# Altium project Tremolo.PrjPCB
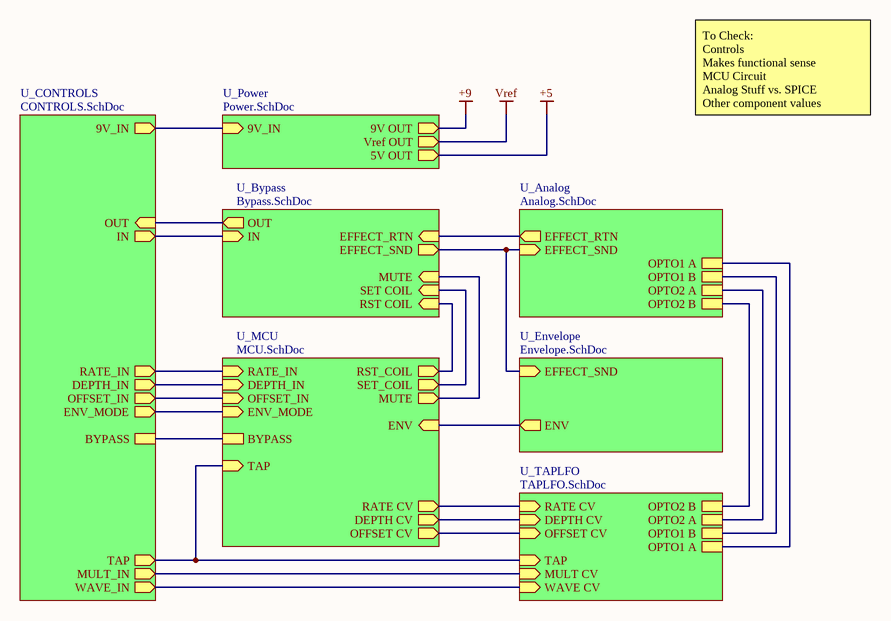
[diagram p0: MASTER.SchDoc]
6 sheets, 80 parts. Net scope: hierarchical (ports join the sheet entries above them; power ports are global).
Board file: PCB1.PcbDoc
Sheets:
  MASTER.SchDoc
    U_Analog = Analog.SchDoc
    U_Bypass = Bypass.SchDoc
    U_MCU = MCU.SchDoc
    U_Power = Power.SchDoc
    U_TAPLFO = TAPLFO.SchDoc

## Sheet MASTER.SchDoc
size A

### Sub-sheets
U_Analog = Analog.SchDoc: EFFECT_RTN (out), EFFECT_SND (in), OPTO1 A, OPTO1 B, OPTO2 A, OPTO2 B
U_Bypass = Bypass.SchDoc: EFFECT_RTN (in), IN (in), OUT (out), EFFECT_SND (out), MUTE (in), RST COIL (in), SET COIL (in)
U_CONTROLS = CONTROLS.SchDoc (file not in this document): RATE_IN (out), DEPTH_IN (out), OFFSET_IN (out), MULT_IN (out), IN (out), OUT (in), WAVE_IN (out), TAP (out), 9V_IN (out), BYPASS, ENV_MODE (out)
U_Envelope = Envelope.SchDoc (file not in this document): EFFECT_SND (in), ENV (out)
U_MCU = MCU.SchDoc: RATE_IN (in), OFFSET_IN (in), RATE CV (out), DEPTH CV (out), OFFSET CV (out), TAP (in), MUTE (out), SET_COIL (out), RST_COIL (out), BYPASS, ENV (in), DEPTH_IN (in), ENV_MODE (in)
U_Power = Power.SchDoc: 9V_IN (in), Vref OUT (out), 9V OUT (out), 5V OUT (out)
U_TAPLFO = TAPLFO.SchDoc: RATE CV (in), WAVE CV (in), MULT CV (in), DEPTH CV (in), OFFSET CV (in), TAP (in), OPTO1 A, OPTO1 B, OPTO2 A, OPTO2 B

### Nets
+9: sheet U_CONTROLS/9V_IN, sheet U_Power/9V_IN, sheet U_Power/9V OUT
ENV_MODE: sheet U_CONTROLS/ENV_MODE, sheet U_MCU/ENV_MODE
MUTE: sheet U_Bypass/MUTE, sheet U_MCU/MUTE
RESET_COIL: sheet U_Bypass/RST COIL, sheet U_MCU/RST_COIL
SET_COIL: sheet U_Bypass/SET COIL, sheet U_MCU/SET_COIL
Net*_4: sheet U_CONTROLS/TAP, sheet U_MCU/TAP, sheet U_TAPLFO/TAP
NetC1_1: sheet U_Analog/OPTO1 A, sheet U_TAPLFO/OPTO1 A
NetC3_1: sheet U_Analog/EFFECT_SND, sheet U_Bypass/EFFECT_SND, sheet U_Envelope/EFFECT_SND
NetC7_2: sheet U_MCU/DEPTH CV, sheet U_TAPLFO/DEPTH CV
NetC8_2: sheet U_MCU/RATE CV, sheet U_TAPLFO/RATE CV
NetC9_2: sheet U_MCU/OFFSET CV, sheet U_TAPLFO/OFFSET CV
NetJ1_2: sheet U_CONTROLS/DEPTH_IN, sheet U_MCU/DEPTH_IN
NetJ2_2: sheet U_CONTROLS/RATE_IN, sheet U_MCU/RATE_IN
NetJ3_2: sheet U_CONTROLS/OFFSET_IN, sheet U_MCU/OFFSET_IN
NetR4_2: sheet U_Analog/OPTO1 B, sheet U_Analog/OPTO2 B, sheet U_TAPLFO/OPTO1 B, sheet U_TAPLFO/OPTO2 B
NetR5_1: sheet U_Analog/OPTO2 A, sheet U_TAPLFO/OPTO2 A
NetR18_2: sheet U_CONTROLS/WAVE_IN, sheet U_TAPLFO/WAVE CV
NetR21_2: sheet U_CONTROLS/MULT_IN, sheet U_TAPLFO/MULT CV
NetS3_3: sheet U_Bypass/IN, sheet U_CONTROLS/IN
NetS3_7: sheet U_Analog/EFFECT_RTN, sheet U_Bypass/EFFECT_RTN
NetS3_8: sheet U_Bypass/OUT, sheet U_CONTROLS/OUT
NetU4_24: sheet U_CONTROLS/BYPASS, sheet U_MCU/BYPASS
NetU4_25: sheet U_MCU/ENV, sheet U_Envelope/ENV

### Notes on the sheet
- To Check:
  Controls
  Makes functional sense
  MCU Circuit
  Analog Stuff vs. SPICE
  Other component values

## Sheet Analog.SchDoc
size A
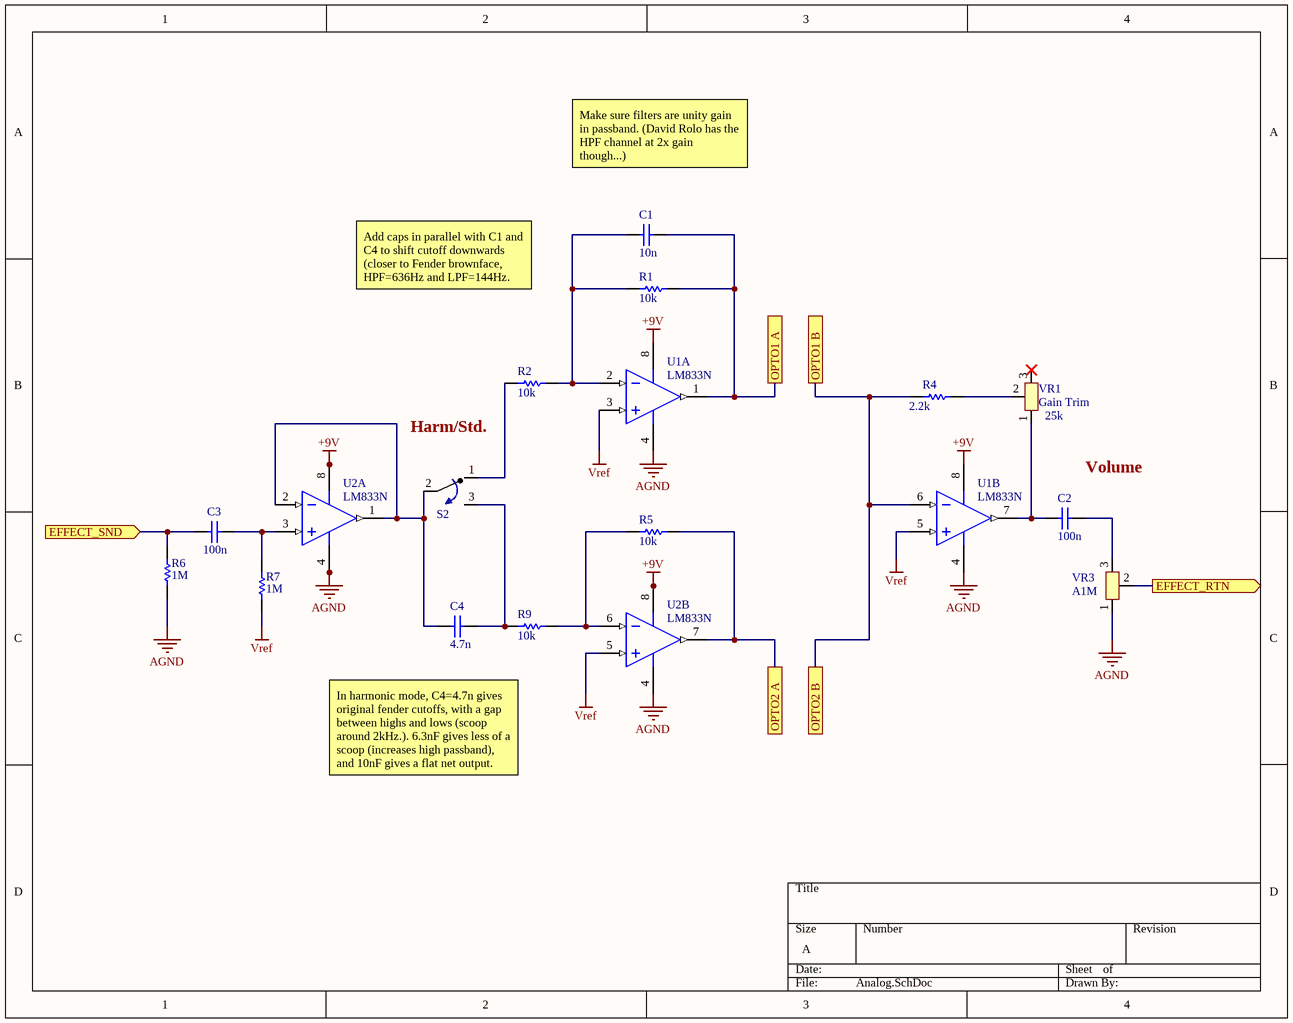
[diagram p1: Analog.SchDoc]

### Parts
C1  value 10n  [RAD-0.3]  (hidden comment: Cap)
C2  value 100n  [RAD-0.3]  (hidden comment: Cap)
C3  value 100n  [RAD-0.3]  (hidden comment: Cap)
C4  value 4.7n  [RAD-0.3]  (hidden comment: Cap)
R1  value 10k  [AXIAL-0.3]  (hidden comment: Res1)
R2  value 10k  [AXIAL-0.3]  (hidden comment: Res1)
R4  value 2.2k  [AXIAL-0.3]  (hidden comment: Res1)
R5  value 10k  [AXIAL-0.3]  (hidden comment: Res1)
R6  value 1M  [AXIAL-0.3]  (hidden comment: Res1)
R7  value 1M  [AXIAL-0.3]  (hidden comment: Res1)
R9  value 10k  [AXIAL-0.3]  (hidden comment: Res1)
S2  SPDT Toggle  [SPDT Toggle]  (value not drawn)
U1  LM833N  [626-05]  (parts A,B of 2)
U2  LM833N  [626-05]  (parts A,B of 2)
VR1  Gain Trim  value 25k  [Trimpot - Bourns]
VR3  value A1M  [Pot-16mm]  (hidden comment: Pot-16mm)

### Ports
EFFECT_RTN (out), EFFECT_SND (in), OPTO1 A, OPTO1 B, OPTO2 A, OPTO2 B

### Nets
+9V: U1.8(V+) U2.8(V+)
AGND: R6.1 U1.4(V-) U2.4(V-) VR3.1
Vref: R7.1 U1.3(IN+) U1.5(IN+) U2.5(IN+)
NetC1_1: C1.1 R1.1 U1.1(OUT) ; port OPTO1 A
NetC1_2: C1.2 R1.2 R2.1 U1.2(IN-)
NetC2_1: C2.1 VR3.3
NetC2_2: C2.2 U1.7(OUT) VR1.1
NetC3_1: C3.1 R6.2 ; port EFFECT_SND
NetC3_2: C3.2 R7.2 U2.3(IN+)
NetC4_1: C4.1 R9.2 S2.3
NetC4_2: C4.2 S2.2 U2.1(OUT) U2.2(IN-)
NetR2_2: R2.2 S2.1
NetR4_1: R4.1 VR1.2
NetR4_2: R4.2 U1.6(IN-) ; port OPTO1 B, port OPTO2 B
NetR5_1: R5.1 U2.7(OUT) ; port OPTO2 A
NetR5_2: R5.2 R9.1 U2.6(IN-)
NetS3_7: VR3.2 ; port EFFECT_RTN

Not connected (* = marked no-connect by the designer): VR1 3*

### Notes on the sheet
- Make sure filters are unity gain in passband. (David Rolo has the HPF channel at 2x gain though...)
- Add caps in parallel with C1 and C4 to shift cutoff downwards (closer to Fender brownface, HPF=636Hz and LPF=144Hz.
- Harm/Std.
- (near C2) Volume
- In harmonic mode, C4=4.7n gives original fender cutoffs, with a gap between highs and lows (scoop around 2kHz.). 6.3nF gives less of a scoop (increases high passband), and 10nF gives a flat net output.

### Library data of the parts
C1-C4 = Cap: Capacitor; Published: 8-Jun-2000; LatestRevisionDate: 17-Jul-2002; LatestRevisionNote: Re-released for DXP Platform.; PackageReference: RAD-0.3; Publisher: Altium Limited; PackageDescription: Radial Cap, Thru-Hole; 2 Leads; 0.3 in Pin Spacing
R1 R2 R4-R7 R9 = Res1: Resistor; Published: 8-Jun-2000; LatestRevisionDate: 17-Jul-2002; LatestRevisionNote: Re-released for DXP Platform.; PackageReference: AXIAL-0.3; Publisher: Altium Limited; PackageDescription: Axial Device, Thru-Hole; 2 Leads; 0.3 in Pin Spacing
U1 U2 = LM833N: Low-Noise, Audio Dual Operational Amplifier; Published: 28-Feb-2003; DatasheetVersion: Jan-2002, Rev. 2; PackageVersion: 1998; PackageReference: 626-05; Publisher: Altium Limited; PackageDescription: DIP; 8 Leads; Row Spacing 7.62 mm; Pitch 2.54 mm; ComponentLink1Description: Manufacturer Link; ComponentLink1URL: http://www.onsemi.com/; ComponentLink2Description: Datasheet; ComponentLink2URL: http://www.onsemi.com/pub/Collateral/LM833-D.PDF
VR1 = Trimpot - Bourns

## Sheet Bypass.SchDoc
size A
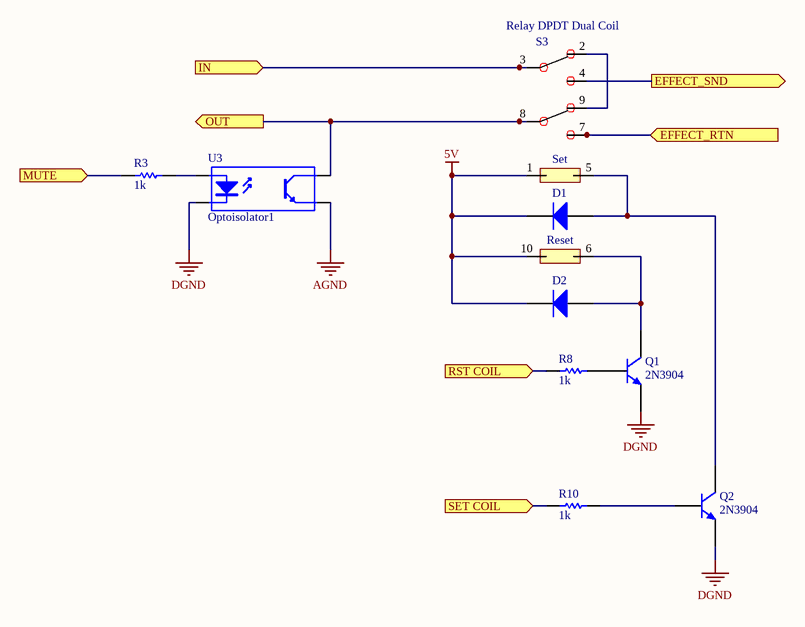
[diagram p2: Bypass.SchDoc]

### Parts
D1  Diode 1N4148  [DO-35]  (value not drawn)
D2  Diode 1N4148  [DO-35]  (value not drawn)
Q1  2N3904  [TO-92A]
Q2  2N3904  [TO-92A]
R3  1k  [ERA-0805]
R8  1k  [ERA-0805]
R10  1k  [ERA-0805]
S3  Relay DPDT Dual Coil  [EB2 Relay]
U3  Optoisolator1  [DIP-4]

### Ports
EFFECT_RTN (in), EFFECT_SND (out), IN (in), MUTE (in), OUT (out), RST COIL (in), SET COIL (in)

### Nets
5V: D1.2(K) D2.2(K) S3.1 S3.10
AGND: U3.3(E)
DGND: Q1.1(E) Q2.1(E) U3.2(K)
MUTE: R3.2 ; port MUTE
RESET_COIL: R8.2 ; port RST COIL
SET_COIL: R10.2 ; port SET COIL
NetC3_1: S3.4 ; port EFFECT_SND
NetD1_1: D1.1(A) Q2.3(C) S3.5
NetD2_1: D2.1(A) Q1.3(C) S3.6
NetQ1_2: Q1.2(B) R8.1
NetQ2_2: Q2.2(B) R10.1
NetR3_1: R3.1 U3.1(A)
NetS3_2: S3.2 S3.9
NetS3_3: S3.3 ; port IN
NetS3_7: S3.7 ; port EFFECT_RTN
NetS3_8: S3.8 U3.4(C) ; port OUT

### Notes on the sheet
- (in symbol Relay DPDT Dual Coil) Set; Reset

### Library data of the parts
D1 D2 = Diode 1N4148: High Conductance Fast Diode; Published: 8-Jun-2000; LatestRevisionDate: 17-Jul-2002; LatestRevisionNote: Re-released for DXP Platform.; DatasheetVersion: 1997; PackageReference: DO-35; Publisher: Altium Limited; PackageDescription: Diode, Axial; Body 3.8 x 1.9 mm (LxDia. max), Lead Dia. 0.53 mm (max); Code_JEDEC: DO-204-AH; ComponentLink1Description: Manufacturer Link; ComponentLink1URL: http://www.fairchildsemi.com/; ComponentLink2Description: Datasheet; ComponentLink2URL: http://www.fairchildsemi.com/ds/1N%2F1N4148.pdf
Q1 Q2 = 2N3904: NPN General Purpose Amplifier; Published: 8-Jun-2000; LatestRevisionDate: 15-Jan-2003; LatestRevisionNote: PCB Footprint 'BCY-W3/D4.7' replaced; DatasheetVersion: 1997; PackageVersion: Sep-1998; PackageReference: TO-92A; Publisher: Altium Limited; PackageDescription: TO, Flat Index; 3 In-Line, Axial Leads; Body Dia. 4.5mm; Leads 0.51 x 0.48 mm (max); ComponentLink1Description: Manufacturer Link; ComponentLink1URL: http://www.fairchildsemi.com/; ComponentLink2Description: Datasheet; ComponentLink2URL: http://www.fairchildsemi.com/ds/2N%2F2N3904.pdf
R3 R8 R10 = ERAS: Metal Film Thermosensitive Chip Resistor, 0.56 Ohm to 10k Ohm Range, 5% Tolerance, 0805 Size, 0.1 W; Note: If flow soldering, adjust pad width of PCB Footprint to 0.7 - 0.8 times the width of the resistor.; Published: 17-Dec-2003; LatestRevisionDate: 19-Mar-2004; LatestRevisionNote: Silkscreen size reduced.; PackageDocument: Mar-2003; PackageReference: ERA-0805; Publisher: Altium Limited; Code_IPC: 2012 [0805]; ComponentLink1Description: Manufacturer Link; ComponentLink1URL: http://www.panasonic.com/industrial/components/resistive_products.htm; ComponentLink2Description: Datasheet; ComponentLink2URL: http://www.panasonic.com/industrial/components/pdf/AOF0000CE1.pdf
U3 = Optoisolator1: 4-Pin Phototransistor Optocoupler; Published: 24-Mar-1999; LatestRevisionDate: 04-Mar-2005; LatestRevisionNote: Sch pins 3 & 4 Swapped.; DatasheetVersion: Nov-2003; PackageReference: DIP-4; Publisher: Altium Limited

## Sheet MCU.SchDoc
size A
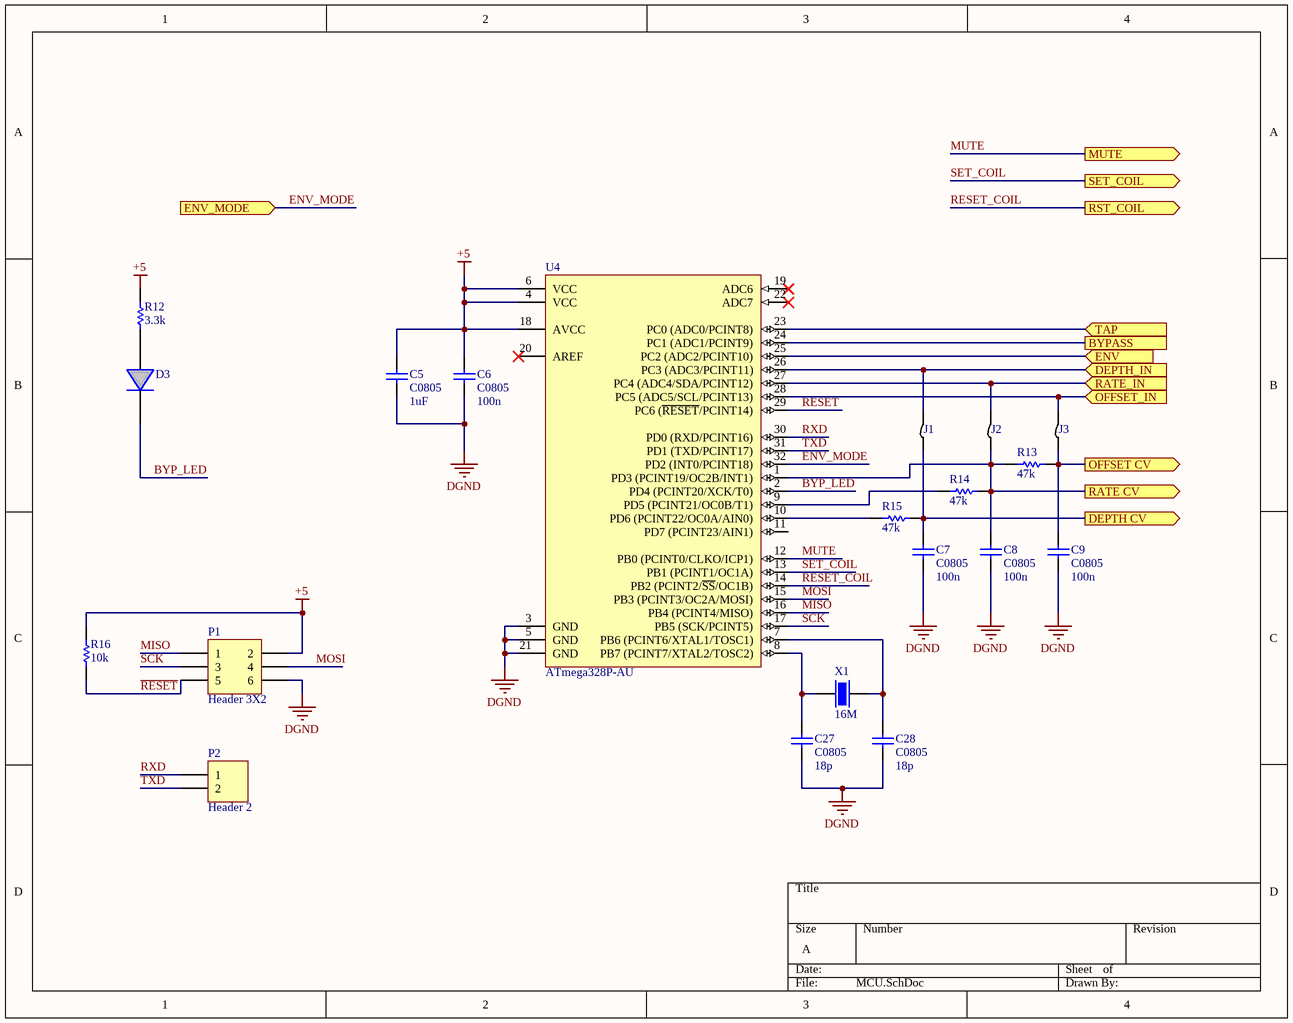
[diagram p3: MCU.SchDoc]

### Parts
C5  C0805  value 1uF  [0805]
C6  C0805  value 100n  [0805]
C7  C0805  value 100n  [0805]
C8  C0805  value 100n  [0805]
C9  C0805  value 100n  [0805]
C27  C0805  value 18p  [0805]
C28  C0805  value 18p  [0805]
D3  LED5MM  [LED5MM]  (value not drawn)
J1  Jumper  [Jumper]  (value not drawn)
J2  Jumper  [Jumper]  (value not drawn)
J3  Jumper  [Jumper]  (value not drawn)
P1  Header 3X2  [HDR2X3]
P2  Header 2  [HDR1X2]
R12  3.3k  [ERA-0805]
R13  47k  [ERA-0805]
R14  47k  [ERA-0805]
R15  47k  [ERA-0805]
R16  10k  [ERA-0805]
U4  ATmega328P-AU  [32A_N]
X1  16M  [XTAL PTH]

### Ports
BYPASS, DEPTH CV (out), DEPTH_IN (in), ENV (in), ENV_MODE (in), MUTE (out), OFFSET CV (out), OFFSET_IN (in), RATE CV (out), RATE_IN (in), RST_COIL (out), SET_COIL (out), TAP (in)

### Nets
+5: C5.2 C6.2 P1.2 R12.2 R16.2 U4.4(VCC) U4.6(VCC) U4.18(AVCC)
DGND: C5.1 C6.1 C7.1 C8.1 C9.1 C27.1 C28.1 P1.6 U4.3(GND) U4.5(GND) U4.21(GND)
BYP_LED: D3.1 U4.2(PD4_(PCINT20/XCK/T0))
ENV_MODE: U4.32(PD2_(INT0/PCINT18)) ; port ENV_MODE
MISO: P1.1 U4.16(PB4_(PCINT4/MISO))
MOSI: P1.4 U4.15(PB3_(PCINT3/OC2A/MOSI))
MUTE: U4.12(PB0_(PCINT0/CLKO/ICP1)) ; port MUTE
~{RESET}: P1.5 R16.1 U4.29(PC6_(~{RESET}/PCINT14))
RESET_COIL: U4.14(PB2_(PCINT2/~{SS}/OC1B)) ; port RST_COIL
RXD: P2.1 U4.30(PD0_(RXD/PCINT16))
SCK: P1.3 U4.17(PB5_(SCK/PCINT5))
SET_COIL: U4.13(PB1_(PCINT1/OC1A)) ; port SET_COIL
TXD: P2.2 U4.31(PD1_(TXD/PCINT17))
Net*_4: U4.23(PC0_(ADC0/PCINT8)) ; port TAP
NetC7_2: C7.2 J1.1 R15.2 ; port DEPTH CV
NetC8_2: C8.2 J2.1 R13.1 R14.2 U4.1(PD3_(PCINT19/OC2B/INT1)) ; port RATE CV
NetC9_2: C9.2 J3.1 R13.2 ; port OFFSET CV
NetC27_2: C27.2 U4.8(PB7_(PCINT7/XTAL2/TOSC2)) X1.1
NetC28_2: C28.2 U4.7(PB6_(PCINT6/XTAL1/TOSC1)) X1.2
NetD3_0: D3.0 R12.1
NetJ1_2: J1.2 U4.26(PC3_(ADC3/PCINT11)) ; port DEPTH_IN
NetJ2_2: J2.2 U4.27(PC4_(ADC4/SDA/PCINT12)) ; port RATE_IN
NetJ3_2: J3.2 U4.28(PC5_(ADC5/SCL/PCINT13)) ; port OFFSET_IN
NetR14_1: R14.1 U4.9(PD5_(PCINT21/OC0B/T1))
NetR15_1: R15.1 U4.10(PD6_(PCINT22/OC0A/AIN0))
NetU4_24: U4.24(PC1_(ADC1/PCINT9)) ; port BYPASS
NetU4_25: U4.25(PC2_(ADC2/PCINT10)) ; port ENV

Not connected (* = marked no-connect by the designer): U4 11(PD7_(PCINT23/AIN1)) 19(ADC6)* 20(AREF)* 22(ADC7)*

### Library data of the parts
C5-C9 C27 C28 = C0805: Ceramic Chip Capacitor - Standard; Note: Footprint corresponds to dimensions for bulk cassette packaging. This case size has tightened tolerances.; Published: 17-Jul-2002; LatestRevisionDate: 19-Mar-2004; LatestRevisionNote: Silkscreen size reduced.; DatasheetDocument: Mar-2001; PackageDocument: Mar-2001; PackageReference: 0805; Publisher: Altium Limited; Code_JEITA: 0805; Code_IPC: 2012[0805]; ComponentLink1Description: Manufacturer Link; ComponentLink1URL: http://www.kemet.com/; ComponentLink2Description: Datasheet; ComponentLink2URL: http://www.kemet.com/kemet/web/homepage/kechome.nsf/vapubfilesname/F3102TA.pdf/$file/F3102TA.pdf
P1 = Header 3X2: Header, 3-Pin, Dual row; LatestRevisionDate: 17-Jul-2002; LatestRevisionNote: Re-released for DXP Platform.; Publisher: Altium Limited
P2 = Header 2: Header, 2-Pin; LatestRevisionDate: 17-Jul-2002; LatestRevisionNote: Re-released for DXP Platform.; Publisher: Altium Limited
R12-R16 = ERAS: Resistor 0805; Note: If flow soldering, adjust pad width of PCB Footprint to 0.7 - 0.8 times the width of the resistor.; Published: 17-Dec-2003; LatestRevisionDate: 19-Mar-2004; LatestRevisionNote: Silkscreen size reduced.; PackageDocument: Mar-2003; PackageReference: ERA-0805; Publisher: Altium Limited; Code_IPC: 2012 [0805]; ComponentLink1Description: Manufacturer Link; ComponentLink1URL: http://www.panasonic.com/industrial/components/resistive_products.htm; ComponentLink2Description: Datasheet; ComponentLink2URL: http://www.panasonic.com/industrial/components/pdf/AOF0000CE1.pdf
U4 = ATmega328P-AU: 8-bit AVR Microcontroller, 32KB Flash, 1KB EEPROM, 2KB SRAM, 32-pin TQFP, Industrial Grade (-40°C to 85°C); Published: 1-Apr-2010; DatasheetVersion: revA, Jan-2010; PackageVersion: revB, Oct-2001; PackageReference: 32A; Publisher: Altium Limited; PackageDescription: 32-Lead, 7x7x1.0 mm Body, 0.8mm Lead Pitch, Thin Profile Plastic Quad Flat Package (TQFP); Supplier 1: Digi-Key; Supplier Part Number 1: ATMEGA328P-AU-ND; Supplier 2: Farnell; Supplier Part Number 2: 1715486; Supplier 3: Mouser; Supplier Part Number 3: 556-ATMEGA328P-AU; Code_JEDEC: MS-026-ABA; ComponentLink1Description: Manufacturer Link; ComponentLink1URL: http://www.atmel.com/products/avr/default.asp?; ComponentLink2Description: ATmega48A/48PA/88A/88PA/168A/168PA/328/328P Datasheet; ComponentLink2URL: http://www.atmel.com/dyn/resources/prod_documents/8271.pdf; ComponentLink3Description: ATmega48A/48PA/88A/88PA/168A/168PA/328/328P Summary; ComponentLink3URL: http://www.atmel.com/dyn/resources/prod_documents/8271S.pdf; ComponentLink4Description: Atmel.com Home; ComponentLink4URL: http://www.atmel.com
X1 = Crystal PTH: MPN: ECS-160-20-4X

## Sheet Power.SchDoc
size A
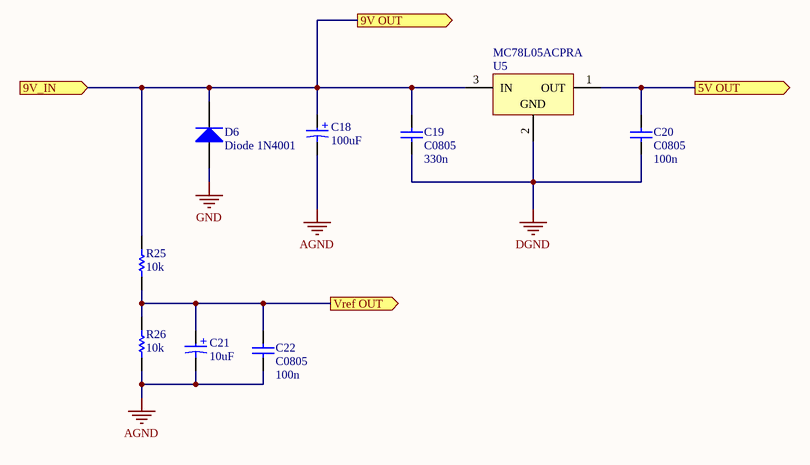
[diagram p4: Power.SchDoc]

### Parts
C18  value 100uF  [100uF CAP 2.5mm]  (hidden comment: CAP ELEC 100uF)
C19  C0805  value 330n  [0805]
C20  C0805  value 100n  [0805]
C21  value 10uF  [CAP 10uF]  (hidden comment: CAP ELEC 10uF)
C22  C0805  value 100n  [0805]
D6  Diode 1N4001  [DO-41]
R25  10k  [ERA-0805]
R26  10k  [ERA-0805]
U5  MC78L05ACPRA  [29-04]

### Ports
5V OUT (out), 9V OUT (out), 9V_IN (in), Vref OUT (out)

### Nets
+5: C20.2 U5.1(OUT) ; port 5V OUT
+9: C18.1 C19.2 D6.2(K) R25.2 U5.3(IN) ; port 9V OUT, port 9V_IN
AGND: C18.2 C21.2 C22.1 R26.1
DGND: C19.1 C20.1 U5.2(GND)
GND: D6.1(A)
Vref: C21.1 C22.2 R25.1 R26.2 ; port Vref OUT

### Notes on the sheet
- (in symbol CAP ELEC 10uF) +
- (in symbol CAP ELEC 100uF) +

### Library data of the parts
C18 = CAP ELEC 100uF: MPN: UFW1E101MED1TD; Manufacturer: Nichicon; Voltage Rating: 25V; Height: 11mm
C19 C20 C22 = C0805: as C5 on sheet MCU; Published: 17-Jul-2002; LatestRevisionDate: 19-Mar-2004; LatestRevisionNote: Silkscreen size reduced.; DatasheetDocument: Mar-2001; PackageDocument: Mar-2001; PackageReference: 0805; Publisher: Altium Limited; Code_JEITA: 0805; Code_IPC: 2012[0805]; ComponentLink1Description: Manufacturer Link; ComponentLink1URL: http://www.kemet.com/; ComponentLink2Description: Datasheet; ComponentLink2URL: http://www.kemet.com/kemet/web/homepage/kechome.nsf/vapubfilesname/F3102TA.pdf/$file/F3102TA.pdf
C21 = CAP ELEC 10uF: MPN: USR1E100MDD1TE; Manufacturer: Nichicon; Voltage Rating: 25V; Height: 11mm
D6 = Diode 1N4001: 1 Amp General Purpose Rectifier; Published: 8-Jun-2000; LatestRevisionDate: 17-Jul-2002; LatestRevisionNote: Re-released for DXP Platform.; DatasheetVersion: 1998; PackageVersion: Aug-1999; PackageReference: DO-41; Publisher: Altium Limited; PackageDescription: Diode, Axial; Body 5.2 x 2.7 mm (LxDia. max), Lead Dia. 0.86 mm (max); Code_JEDEC: DO-204-AL; ComponentLink1Description: Manufacturer Link; ComponentLink1URL: http://www.fairchildsemi.com/; ComponentLink2Description: Datasheet; ComponentLink2URL: http://www.fairchildsemi.com/ds/1N%2F1N4001.pdf
R25 R26 = ERAS: as R3 on sheet Bypass; Published: 17-Dec-2003; LatestRevisionDate: 19-Mar-2004; LatestRevisionNote: Silkscreen size reduced.; PackageDocument: Mar-2003; PackageReference: ERA-0805; Publisher: Altium Limited; Code_IPC: 2012 [0805]; ComponentLink1Description: Manufacturer Link; ComponentLink1URL: http://www.panasonic.com/industrial/components/resistive_products.htm; ComponentLink2Description: Datasheet; ComponentLink2URL: http://www.panasonic.com/industrial/components/pdf/AOF0000CE1.pdf
U5 = MC78L05ACPRA: Three-Terminal Low Current Positive Voltage Regulator; Published: 15-Apr-2002; DatasheetVersion: Oct-1999; PackageVersion: 1996; PackageReference: 29-04; Publisher: Altium Limited; PackageDescription: TO, Flat Index; 3 In-Line, Axial Leads; Body Dia. 4.8mm; Leads 0.48 x 0.51 mm (max); ComponentLink1Description: Manufacturer Link; ComponentLink1URL: http://www.onsemi.com/site/products/taxonomy/0,4438,503,00.html; ComponentLink2Description: Datasheet; ComponentLink2URL: http://www.onsemi.com/pub/Collateral/MC78L00A-D.PDF

## Sheet TAPLFO.SchDoc
size A
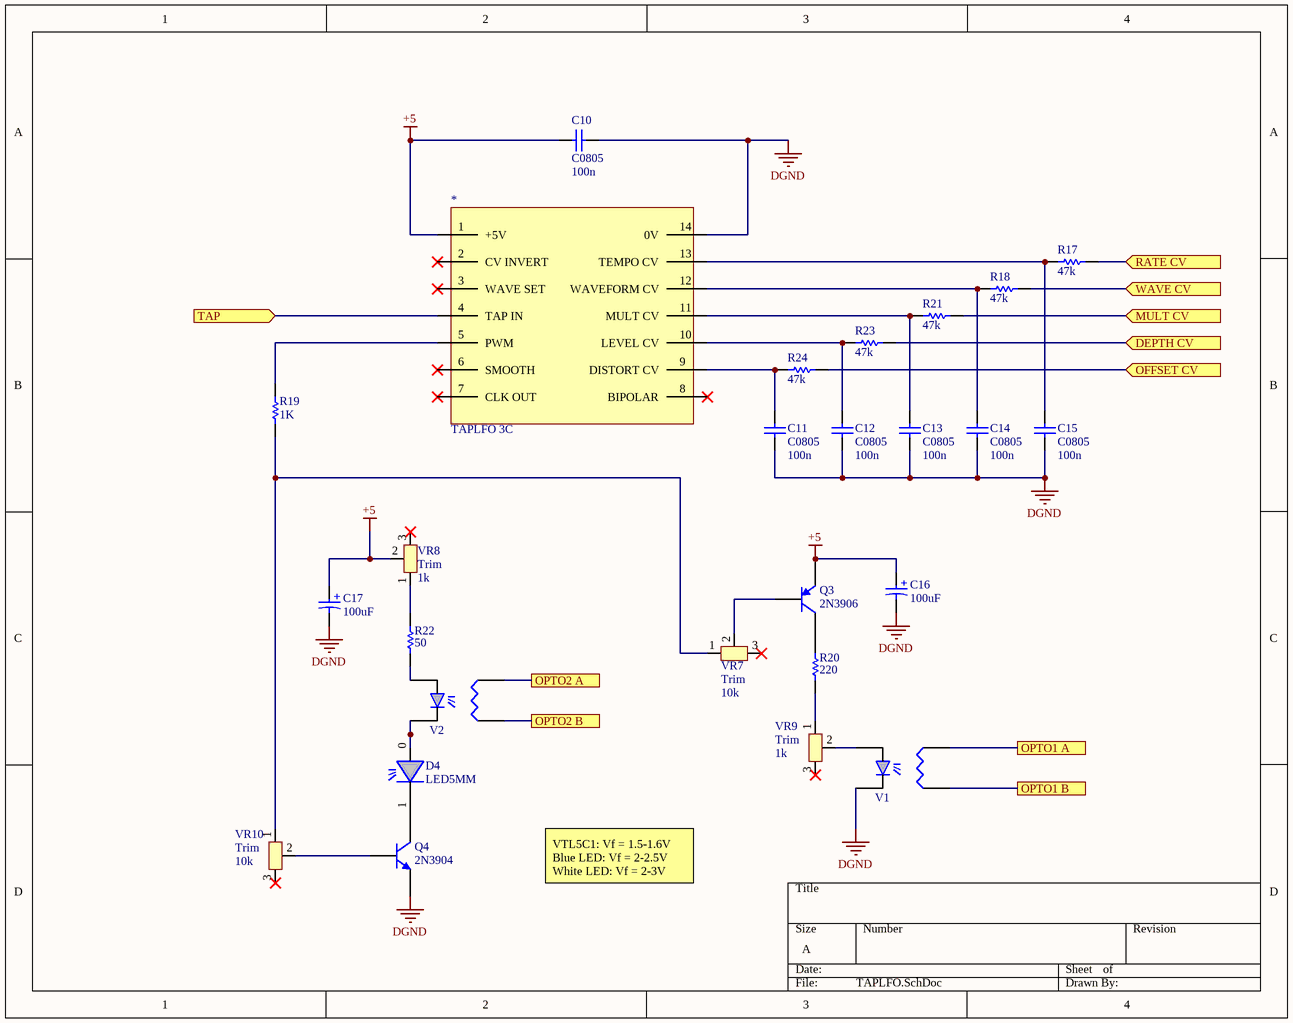
[diagram p5: TAPLFO.SchDoc]

### Parts
*  TAPLFO 3C  [DIP-14]
C10  C0805  value 100n  [0805]
C11  C0805  value 100n  [0805]
C12  C0805  value 100n  [0805]
C13  C0805  value 100n  [0805]
C14  C0805  value 100n  [0805]
C15  C0805  value 100n  [0805]
C16  value 100uF  [100uF CAP 2.5mm]  (hidden comment: CAP ELEC 100uF)
C17  value 100uF  [100uF CAP 2.5mm]  (hidden comment: CAP ELEC 100uF)
D4  LED5MM  [LED5MM]
Q3  2N3906  [TO-92A]
Q4  2N3904  [TO-92A]
R17  47k  [ERA-0805]
R18  47k  [ERA-0805]
R19  value 1K  [AXIAL-0.3]  (hidden comment: Res1)
R20  value 220  [AXIAL-0.3]  (hidden comment: Res1)
R21  47k  [ERA-0805]
R22  value 50  [AXIAL-0.3]  (hidden comment: Res1)
R23  47k  [ERA-0805]
R24  47k  [ERA-0805]
V1  Vactrol  [VACTROL]  (value not drawn)
V2  Vactrol  [VACTROL]  (value not drawn)
VR7  Trim  value 10k  [Trimpot - Bourns]
VR8  Trim  value 1k  [Trimpot - Bourns]
VR9  Trim  value 1k  [Trimpot - Bourns]
VR10  Trim  value 10k  [Trimpot - Bourns]

### Ports
DEPTH CV (in), MULT CV (in), OFFSET CV (in), OPTO1 A, OPTO1 B, OPTO2 A, OPTO2 B, RATE CV (in), TAP (in), WAVE CV (in)

### Nets
+5: *.1(+5V) C10.2 C16.1 C17.1 Q3.1(E) VR8.2
DGND: *.14(0V) C10.1 C11.1 C12.1 C13.1 C14.1 C15.1 C16.2 C17.2 Q4.1(E) V1.1
Net*_4: *.4(TAP_IN) ; port TAP
Net*_5: *.5(PWM) R19.1
Net*_9: *.9(DISTORT_CV) C11.2 R24.1
Net*_10: *.10(LEVEL_CV) C12.2 R23.1
Net*_11: *.11(MULT_CV) C13.2 R21.1
Net*_12: *.12(WAVEFORM_CV) C14.2 R18.1
Net*_13: *.13(TEMPO_CV) C15.2 R17.1
NetC1_1: V1.3 ; port OPTO1 A
NetC7_2: R23.2 ; port DEPTH CV
NetC8_2: R17.2 ; port RATE CV
NetC9_2: R24.2 ; port OFFSET CV
NetD4_0: D4.0 V2.1
NetD4_1: D4.1 Q4.3(C)
NetQ3_2: Q3.2(B) VR7.2
NetQ3_3: Q3.3(C) R20.2
NetQ4_2: Q4.2(B) VR10.2
NetR4_2: V1.2 V2.2 ; port OPTO2 B, port OPTO1 B
NetR5_1: V2.3 ; port OPTO2 A
NetR18_2: R18.2 ; port WAVE CV
NetR19_2: R19.2 VR7.1 VR10.1
NetR20_1: R20.1 VR9.1
NetR21_2: R21.2 ; port MULT CV
NetR22_1: R22.1 V2.0
NetR22_2: R22.2 VR8.1
NetV1_0: V1.0 VR9.2

Not connected (* = marked no-connect by the designer): * 2(CV_INVERT)* 3(WAVE_SET)* 6(SMOOTH)* 7(CLK_OUT)* 8(BIPOLAR)*; VR7 3*; VR8 3*; VR9 3*; VR10 3*

### Notes on the sheet
- VTL5C1: Vf = 1.5-1.6V
  Blue LED: Vf = 2-2.5V
  White LED: Vf = 2-3V
- (in symbol CAP ELEC 100uF) +

### Library data of the parts
C10-C15 = C0805: as C5 on sheet MCU; Published: 17-Jul-2002; LatestRevisionDate: 19-Mar-2004; LatestRevisionNote: Silkscreen size reduced.; DatasheetDocument: Mar-2001; PackageDocument: Mar-2001; PackageReference: 0805; Publisher: Altium Limited; Code_JEITA: 0805; Code_IPC: 2012[0805]; ComponentLink1Description: Manufacturer Link; ComponentLink1URL: http://www.kemet.com/; ComponentLink2Description: Datasheet; ComponentLink2URL: http://www.kemet.com/kemet/web/homepage/kechome.nsf/vapubfilesname/F3102TA.pdf/$file/F3102TA.pdf
C16 C17 = CAP ELEC 100uF: as C18 on sheet Power; Height: 11mm
Q3 = 2N3906: PNP General Purpose Amplifier; Published: 8-Jun-2000; LatestRevisionDate: 15-Jan-2003; LatestRevisionNote: PCB Footprint 'BCY-W3/D4.7' replaced; DatasheetVersion: 1997; PackageVersion: Sep-1998; PackageReference: TO-92A; Publisher: Altium Limited; PackageDescription: TO, Flat Index; 3 In-Line, Axial Leads; Body Dia. 4.5mm; Leads 0.51 x 0.48 mm (max); ComponentLink1Description: Manufacturer Link; ComponentLink1URL: http://www.fairchildsemi.com/; ComponentLink2Description: Datasheet; ComponentLink2URL: http://www.fairchildsemi.com/ds/2N%2F2N3906.pdf
Q4 = 2N3904: NPN General Purpose Amplifier; Published: 8-Jun-2000; LatestRevisionDate: 15-Jan-2003; LatestRevisionNote: PCB Footprint 'BCY-W3/D4.7' replaced; DatasheetVersion: 1997; PackageVersion: Sep-1998; PackageReference: TO-92A; Publisher: Altium Limited; PackageDescription: TO, Flat Index; 3 In-Line, Axial Leads; Body Dia. 4.5mm; Leads 0.51 x 0.48 mm (max); ComponentLink1Description: Manufacturer Link; ComponentLink1URL: http://www.fairchildsemi.com/; ComponentLink2Description: Datasheet; ComponentLink2URL: http://www.fairchildsemi.com/ds/2N%2F2N3904.pdf
R17 R18 R21 R23 R24 = ERAS: as R12 on sheet MCU; Published: 17-Dec-2003; LatestRevisionDate: 19-Mar-2004; LatestRevisionNote: Silkscreen size reduced.; PackageDocument: Mar-2003; PackageReference: ERA-0805; Publisher: Altium Limited; Code_IPC: 2012 [0805]; ComponentLink1Description: Manufacturer Link; ComponentLink1URL: http://www.panasonic.com/industrial/components/resistive_products.htm; ComponentLink2Description: Datasheet; ComponentLink2URL: http://www.panasonic.com/industrial/components/pdf/AOF0000CE1.pdf
R19 R20 R22 = Res1: Resistor; Published: 8-Jun-2000; LatestRevisionDate: 17-Jul-2002; LatestRevisionNote: Re-released for DXP Platform.; PackageReference: AXIAL-0.3; Publisher: Altium Limited; PackageDescription: Axial Device, Thru-Hole; 2 Leads; 0.3 in Pin Spacing
VR7-VR10 = Trimpot - Bourns

## Nets that join several sheets
+5: MCU (8 pins), Power (C20.2 U5.1), TAPLFO (6 pins)
AGND: Analog (R6.1 U1.4 U2.4 VR3.1), Bypass (U3.3), Power (C18.2 C21.2 C22.1 R26.1)
DGND: Bypass (Q1.1 Q2.1 U3.2), MCU (11 pins), Power (C19.1 C20.1 U5.2), TAPLFO (11 pins)
Vref: Analog (R7.1 U1.3 U1.5 U2.5), Power (C21.1 C22.2 R25.1 R26.2)
MUTE: Bypass (R3.2), MCU (U4.12)
Net*_4: MCU (U4.23), TAPLFO (*.4)
NetC1_1: Analog (C1.1 R1.1 U1.1), TAPLFO (V1.3)
NetC3_1: Analog (C3.1 R6.2), Bypass (S3.4)
NetC7_2: MCU (C7.2 J1.1 R15.2), TAPLFO (R23.2)
NetC8_2: MCU (5 pins), TAPLFO (R17.2)
NetC9_2: MCU (C9.2 J3.1 R13.2), TAPLFO (R24.2)
NetR4_2: Analog (R4.2 U1.6), TAPLFO (V1.2 V2.2)
NetR5_1: Analog (R5.1 U2.7), TAPLFO (V2.3)
NetS3_7: Analog (VR3.2), Bypass (S3.7)
RESET_COIL: Bypass (R8.2), MCU (U4.14)
SET_COIL: Bypass (R10.2), MCU (U4.13)